# Altium project Coral_Dev_Baseboard.PrjPcb (part 5 of 5)

## Sheet 09_EXP_CN_100PIN.SchDoc
size A2; ApprovedBy: DNP; CheckedBy: DNP; Author: DNP; CompanyName: Google LLC; DrawnBy: DNP; Engineer: Bangfei/Michael/Leo; Organization: Google LLC; Address1: 1600 Amphitheatre Parkway; Address2: Mountain View, CA 94043; Address3: DNP; Address4: DNP; DocumentNumber: DNP; Revision: PVT; SheetNumber: 9; SheetTotal: 11; VersionControl_RevNumber: DNP; IsUserConfigurable: DNP; Time: DNP; ImagePath: DNP; Rule: DNP; ProjectName: Enterprise; Application_BuildNumber: DNP
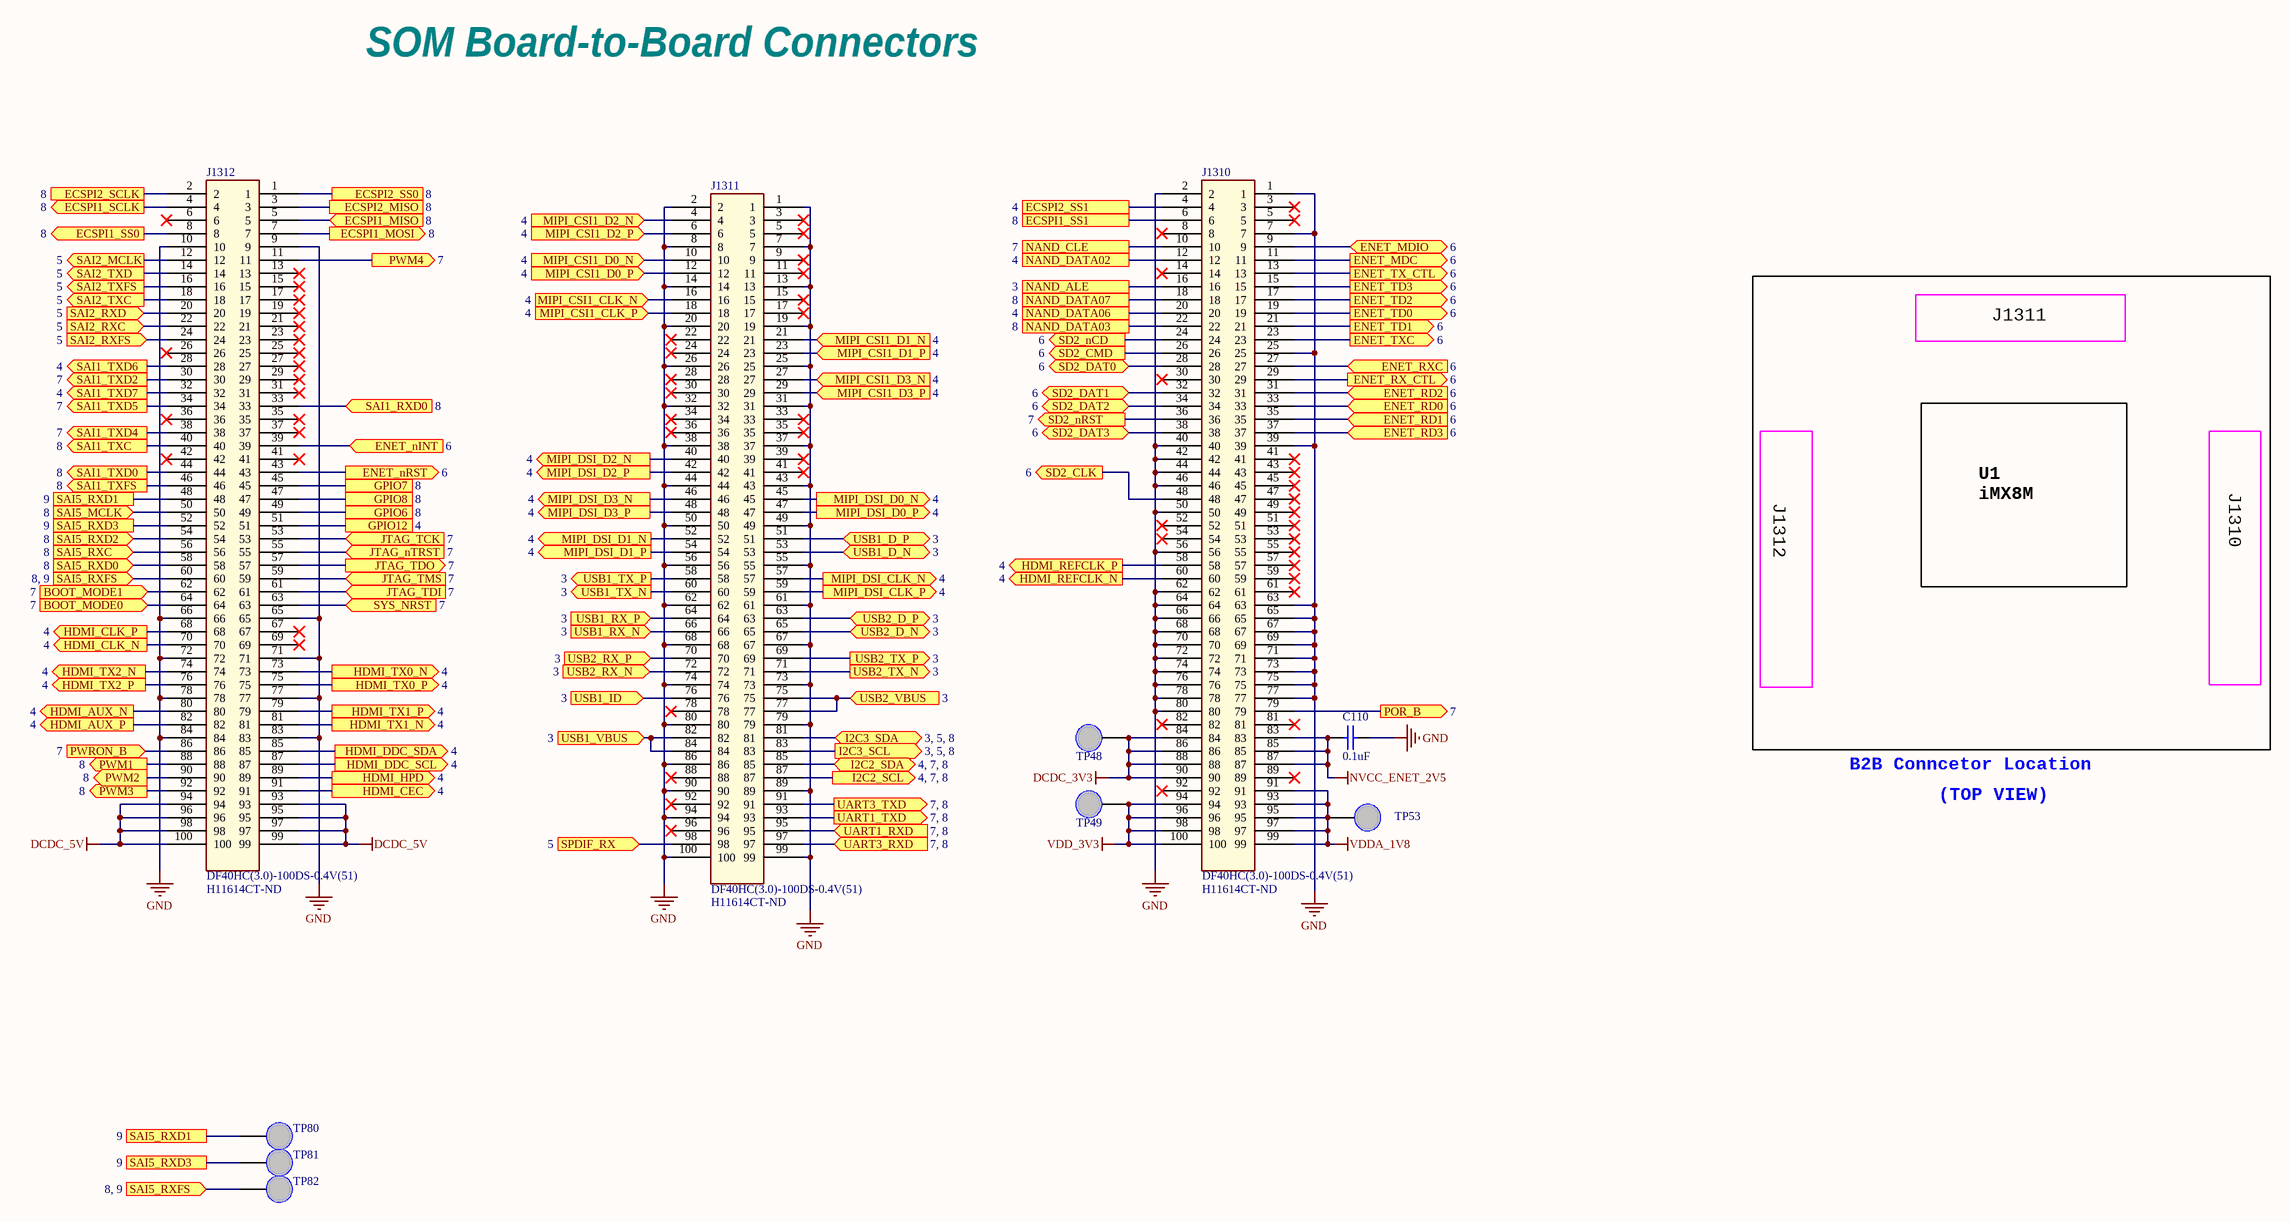
[diagram p13: 09_EXP_CN_100PIN.SchDoc]

### Parts
C110  value 0.1uF  [0201]  (hidden comment: 0.1uF/10V)
J1310  DF40HC(3.0)-100DS-0.4V(51)  Supplier Part Number 1: H11614CT-ND  [DF40HC-3_0-100DS-0_4V-51]
J1311  DF40HC(3.0)-100DS-0.4V(51)  Supplier Part Number 1: H11614CT-ND  [DF40HC-3_0-100DS-0_4V-51]
J1312  DF40HC(3.0)-100DS-0.4V(51)  Supplier Part Number 1: H11614CT-ND  [DF40HC-3_0-100DS-0_4V-51]
TP48  TP NM  [TP_SMD_L]  (value not drawn)  (no BOM)
TP49  TP NM  [TP_SMD_L]  (value not drawn)  (no BOM)
TP53  TP NM  [TP_SMD_L]  (value not drawn)  (no BOM)
TP80  TP NM  [TP_SMD_L]  (value not drawn)  (no BOM)
TP81  TP NM  [TP_SMD_L]  (value not drawn)  (no BOM)
TP82  TP NM  [TP_SMD_L]  (value not drawn)  (no BOM)

### Ports
BOOT_MODE0 (in, see 7), BOOT_MODE1 (in, see 7), ECSPI1_MISO (in, see 8), ECSPI1_MOSI (out, see 8), ECSPI1_SCLK (out, see 8), ECSPI1_SS0 (out, see 8), ECSPI1_SS1 (see 8), ECSPI2_MISO (see 8), ECSPI2_SCLK (see 8), ECSPI2_SS0 (see 8), ECSPI2_SS1 (see 4), ENET_MDC (out, see 6), ENET_MDIO (bidir, see 6), ENET_nINT (in, see 6), ENET_nRST (out, see 6), ENET_RD0 (in, see 6), ENET_RD1 (in, see 6), ENET_RD2 (in, see 6), ENET_RD3 (in, see 6), ENET_RX_CTL (out, see 6), ENET_RXC (in, see 6), ENET_TD0 (out, see 6), ENET_TD1 (out, see 6), ENET_TD2 (out, see 6), ENET_TD3 (out, see 6), ENET_TX_CTL (out, see 6), ENET_TXC (out, see 6), GPIO6 (see 8), GPIO7 (see 8), GPIO8 (see 8), GPIO12 (see 4), HDMI_AUX_N (out, see 4), HDMI_AUX_P (out, see 4), HDMI_CEC (out, see 4), HDMI_CLK_N (out, see 4), HDMI_CLK_P (out, see 4), HDMI_DDC_SCL (out, see 4), HDMI_DDC_SDA (out, see 4), HDMI_HPD (out, see 4), HDMI_REFCLK_N (out, see 4), HDMI_REFCLK_P (out, see 4), HDMI_TX0_N (out, see 4), HDMI_TX0_P (out, see 4), HDMI_TX1_N (out, see 4), HDMI_TX1_P (out, see 4), HDMI_TX2_N (out, see 4), HDMI_TX2_P (out, see 4), I2C2_SCL (out, see 4, 7, 8), I2C2_SDA (bidir, see 4, 7, 8), I2C3_SCL (out, see 3, 5, 8), I2C3_SDA (bidir, see 3, 5, 8), JTAG_nTRST (in, see 7), JTAG_TCK (in, see 7), JTAG_TDI (in, see 7), JTAG_TDO (out, see 7), JTAG_TMS (in, see 7), MIPI_CSI1_CLK_N (in, see 4), MIPI_CSI1_CLK_P (in, see 4), MIPI_CSI1_D0_N (in, see 4), MIPI_CSI1_D0_P (in, see 4), MIPI_CSI1_D1_N (in, see 4), MIPI_CSI1_D1_P (in, see 4), MIPI_CSI1_D2_N (in, see 4), MIPI_CSI1_D2_P (in, see 4), MIPI_CSI1_D3_N (in, see 4), MIPI_CSI1_D3_P (in, see 4), MIPI_DSI_CLK_N (out, see 4), MIPI_DSI_CLK_P (out, see 4), MIPI_DSI_D0_N (out, see 4), MIPI_DSI_D0_P (out, see 4), MIPI_DSI_D1_N (out, see 4), MIPI_DSI_D1_P (out, see 4), MIPI_DSI_D2_N (out, see 4), MIPI_DSI_D2_P (out, see 4), MIPI_DSI_D3_N (out, see 4), MIPI_DSI_D3_P (out, see 4), NAND_ALE (see 3), NAND_CLE (see 7), NAND_DATA02 (see 4), NAND_DATA03 (see 8), NAND_DATA06 (see 4), NAND_DATA07 (see 8), POR_B (out, see 7), PWM1 (out, see 8), PWM2 (out, see 8), PWM3 (out, see 8), PWM4 (out, see 7), PWRON_B (in, see 7), SAI1_RXD0 (in, see 8), SAI1_TXC (out, see 8), SAI1_TXD0 (out, see 8), SAI1_TXD2 (out, see 7), SAI1_TXD4 (out, see 7), SAI1_TXD5 (out, see 7), SAI1_TXD6 (out, see 4), SAI1_TXD7 (out, see 4), SAI1_TXFS (out, see 8), SAI2_MCLK (out, see 5), SAI2_RXC (in, see 5), SAI2_RXD (in, see 5), SAI2_RXFS (in, see 5), SAI2_TXC (out, see 5), SAI2_TXD (out, see 5), SAI2_TXFS (out, see 5), SAI5_MCLK (in, see 8), SAI5_RXC (in, see 8), SAI5_RXD0 (in, see 8), SAI5_RXD1 (see 9), SAI5_RXD2 (in, see 8), SAI5_RXD3 (see 9), SAI5_RXFS (in, see 8, 9), SD2_CLK (out, see 6), SD2_CMD (out, see 6), SD2_DAT0 (bidir, see 6), SD2_DAT1 (bidir, see 6), SD2_DAT2 (bidir, see 6), SD2_DAT3 (bidir, see 6), SD2_nCD (out, see 6), SD2_nRST (out, see 7), SPDIF_RX (in, see 5), SYS_NRST (in, see 7), UART1_RXD (in, see 7, 8), UART1_TXD (out, see 7, 8), UART3_RXD (in, see 7, 8), UART3_TXD (out, see 7, 8), USB1_D_N (bidir, see 3), USB1_D_P (bidir, see 3), USB1_ID (in, see 3), USB1_RX_N (in, see 3), USB1_RX_P (in, see 3), USB1_TX_N (out, see 3), USB1_TX_P (out, see 3), USB1_VBUS (in, see 3), USB2_D_N (bidir, see 3), USB2_D_P (bidir, see 3), USB2_RX_N (in, see 3), USB2_RX_P (in, see 3), USB2_TX_N (out, see 3), USB2_TX_P (out, see 3), USB2_VBUS (in, see 3)

### Nets
DCDC_3V3: J1310.84 J1310.86 J1310.88 J1310.90 TP48.1
DCDC_5V: J1312.93 J1312.94 J1312.95 J1312.96 J1312.97 J1312.98 J1312.99 J1312.100
GND: C110.2 J1310.1 J1310.2 J1310.7 J1310.25 J1310.39 J1310.40 J1310.42 J1310.44 J1310.46 J1310.50 J1310.56 J1310.62 J1310.63 J1310.64 J1310.65 J1310.66 J1310.67 J1310.68 J1310.69 J1310.70 J1310.71 J1310.72 J1310.73 J1310.74 J1310.75 J1310.76 J1310.77 J1310.78 J1310.80 J1311.1 J1311.2 J1311.7 J1311.8 J1311.13 J1311.14 J1311.19 J1311.20 J1311.25 J1311.26 J1311.31 J1311.32 J1311.37 J1311.38 J1311.43 J1311.44 J1311.49 J1311.50 J1311.55 J1311.56 J1311.61 J1311.62 J1311.67 J1311.68 J1311.73 J1311.74 J1311.79 J1311.80 J1311.86 J1311.89 J1311.90 J1311.94 J1311.99 J1311.100 J1312.9 J1312.10 J1312.65 J1312.66 J1312.71 J1312.72 J1312.77 J1312.78 J1312.83 J1312.84
NVCC_ENET_2V5: C110.1 J1310.83 J1310.85 J1310.87
VDD_3V3: J1310.94 J1310.96 J1310.98 J1310.100 TP49.1
VDDA_1V8: J1310.91 J1310.93 J1310.95 J1310.97 J1310.99 TP53.1
BOOT_MODE0: J1312.64 ; port BOOT_MODE0
BOOT_MODE1: J1312.62 ; port BOOT_MODE1
ECSPI1_MISO: J1312.5 ; port ECSPI1_MISO
ECSPI1_MOSI: J1312.7 ; port ECSPI1_MOSI
ECSPI1_SCLK: J1312.4 ; port ECSPI1_SCLK
ECSPI1_SS0: J1312.8 ; port ECSPI1_SS0
ECSPI1_SS1: J1310.6 ; port ECSPI1_SS1
ECSPI2_MISO: J1312.3 ; port ECSPI2_MISO
ECSPI2_SCLK: J1312.2 ; port ECSPI2_SCLK
ECSPI2_SS0: J1312.1 ; port ECSPI2_SS0
ECSPI2_SS1: J1310.4 ; port ECSPI2_SS1
ENET_MDC: J1310.11 ; port ENET_MDC
ENET_MDIO: J1310.9 ; port ENET_MDIO
ENET_nINT: J1312.39 ; port ENET_nINT
ENET_nRST: J1312.43 ; port ENET_nRST
ENET_RD0: J1310.33 ; port ENET_RD0
ENET_RD1: J1310.35 ; port ENET_RD1
ENET_RD2: J1310.31 ; port ENET_RD2
ENET_RD3: J1310.37 ; port ENET_RD3
ENET_RX_CTL: J1310.29 ; port ENET_RX_CTL
ENET_RXC: J1310.27 ; port ENET_RXC
ENET_TD0: J1310.19 ; port ENET_TD0
ENET_TD1: J1310.21 ; port ENET_TD1
ENET_TD2: J1310.17 ; port ENET_TD2
ENET_TD3: J1310.15 ; port ENET_TD3
ENET_TX_CTL: J1310.13 ; port ENET_TX_CTL
ENET_TXC: J1310.23 ; port ENET_TXC
GPIO6: J1312.49 ; port GPIO6
GPIO7: J1312.45 ; port GPIO7
GPIO8: J1312.47 ; port GPIO8
GPIO12: J1312.51 ; port GPIO12
HDMI_AUX_N: J1312.80 ; port HDMI_AUX_N
HDMI_AUX_P: J1312.82 ; port HDMI_AUX_P
HDMI_CEC: J1312.91 ; port HDMI_CEC
HDMI_CLK_N: J1312.70 ; port HDMI_CLK_N
HDMI_CLK_P: J1312.68 ; port HDMI_CLK_P
HDMI_DDC_SCL: J1312.87 ; port HDMI_DDC_SCL
HDMI_DDC_SDA: J1312.85 ; port HDMI_DDC_SDA
HDMI_HPD: J1312.89 ; port HDMI_HPD
HDMI_REFCLK_N: J1310.60 ; port HDMI_REFCLK_N
HDMI_REFCLK_P: J1310.58 ; port HDMI_REFCLK_P
HDMI_TX0_N: J1312.73 ; port HDMI_TX0_N
HDMI_TX0_P: J1312.75 ; port HDMI_TX0_P
HDMI_TX1_N: J1312.81 ; port HDMI_TX1_N
HDMI_TX1_P: J1312.79 ; port HDMI_TX1_P
HDMI_TX2_N: J1312.74 ; port HDMI_TX2_N
HDMI_TX2_P: J1312.76 ; port HDMI_TX2_P
I2C2_SCL: J1311.87 ; port I2C2_SCL
I2C2_SDA: J1311.85 ; port I2C2_SDA
I2C3_SCL: J1311.83 ; port I2C3_SCL
I2C3_SDA: J1311.81 ; port I2C3_SDA
JTAG_nTRST: J1312.55 ; port JTAG_nTRST
JTAG_TCK: J1312.53 ; port JTAG_TCK
JTAG_TDI: J1312.61 ; port JTAG_TDI
JTAG_TDO: J1312.57 ; port JTAG_TDO
JTAG_TMS: J1312.59 ; port JTAG_TMS
MIPI_CSI1_CLK_N: J1311.16 ; port MIPI_CSI1_CLK_N
MIPI_CSI1_CLK_P: J1311.18 ; port MIPI_CSI1_CLK_P
MIPI_CSI1_D0_N: J1311.10 ; port MIPI_CSI1_D0_N
MIPI_CSI1_D0_P: J1311.12 ; port MIPI_CSI1_D0_P
MIPI_CSI1_D1_N: J1311.21 ; port MIPI_CSI1_D1_N
MIPI_CSI1_D1_P: J1311.23 ; port MIPI_CSI1_D1_P
MIPI_CSI1_D2_N: J1311.4 ; port MIPI_CSI1_D2_N
MIPI_CSI1_D2_P: J1311.6 ; port MIPI_CSI1_D2_P
MIPI_CSI1_D3_N: J1311.27 ; port MIPI_CSI1_D3_N
MIPI_CSI1_D3_P: J1311.29 ; port MIPI_CSI1_D3_P
MIPI_DSI_CLK_N: J1311.57 ; port MIPI_DSI_CLK_N
MIPI_DSI_CLK_P: J1311.59 ; port MIPI_DSI_CLK_P
MIPI_DSI_D0_N: J1311.45 ; port MIPI_DSI_D0_N
MIPI_DSI_D0_P: J1311.47 ; port MIPI_DSI_D0_P
MIPI_DSI_D1_N: J1311.52 ; port MIPI_DSI_D1_N
MIPI_DSI_D1_P: J1311.54 ; port MIPI_DSI_D1_P
MIPI_DSI_D2_N: J1311.40 ; port MIPI_DSI_D2_N
MIPI_DSI_D2_P: J1311.42 ; port MIPI_DSI_D2_P
MIPI_DSI_D3_N: J1311.46 ; port MIPI_DSI_D3_N
MIPI_DSI_D3_P: J1311.48 ; port MIPI_DSI_D3_P
NAND_ALE: J1310.16 ; port NAND_ALE
NAND_DATA02: J1310.12 ; port NAND_DATA02
NAND_DATA03: J1310.22 ; port NAND_DATA03
NAND_DATA06: J1310.20 ; port NAND_DATA06
NAND_DATA07: J1310.18 ; port NAND_DATA07
POR_B: J1310.79 ; port POR_B
PWM1: J1312.88 ; port PWM1
PWM2: J1312.90 ; port PWM2
PWM3: J1312.92 ; port PWM3
PWM4: J1312.11 ; port PWM4
SAI1_RXD0: J1312.33 ; port SAI1_RXD0
SAI1_TXC: J1312.40 ; port SAI1_TXC
SAI1_TXD0: J1312.44 ; port SAI1_TXD0
SAI1_TXD4: J1312.38 ; port SAI1_TXD4
SAI1_TXD5: J1312.34 ; port SAI1_TXD5
SAI1_TXD6: J1312.28 ; port SAI1_TXD6
SAI1_TXD7: J1312.32 ; port SAI1_TXD7
SAI1_TXFS: J1312.46 ; port SAI1_TXFS
SAI2_MCLK: J1312.12 ; port SAI2_MCLK
SAI2_RXD: J1312.20 ; port SAI2_RXD
SAI2_TXC: J1312.18 ; port SAI2_TXC
SAI2_TXD: J1312.14 ; port SAI2_TXD
SAI2_TXFS: J1312.16 ; port SAI2_TXFS
SAI5_MCLK: J1312.50 ; port SAI5_MCLK
SAI5_RXC: J1312.56 ; port SAI5_RXC
SAI5_RXD0: J1312.58 ; port SAI5_RXD0
SAI5_RXD2: J1312.54 ; port SAI5_RXD2
SAI5_RXFS: J1312.60 TP82.1 ; port SAI5_RXFS
SD2_nCD: J1310.24 ; port SD2_nCD
SD2_nRST: J1310.36 ; port SD2_nRST
SD_CD_DAT3: J1310.38 ; port SD2_DAT3
SD_CLK: J1310.48 ; port SD2_CLK
SD_CMD: J1310.26 ; port SD2_CMD
SD_DAT0: J1310.28 ; port SD2_DAT0
SD_DAT1: J1310.32 ; port SD2_DAT1
SD_DAT2: J1310.34 ; port SD2_DAT2
SPDIF_RX: J1311.98 ; port SPDIF_RX
SYS_NRST: J1312.63 ; port SYS_NRST
UART1_RXD: J1311.95 ; port UART1_RXD
UART1_TXD: J1311.93 ; port UART1_TXD
UART3_RXD: J1311.97 ; port UART3_RXD
UART3_TXD: J1311.91 ; port UART3_TXD
USB1_D_N: J1311.53 ; port USB1_D_N
USB1_D_P: J1311.51 ; port USB1_D_P
USB1_ID: J1311.76 ; port USB1_ID
USB1_RX_N: J1311.66 ; port USB1_RX_N
USB1_RX_P: J1311.64 ; port USB1_RX_P
USB1_TX_N: J1311.60 ; port USB1_TX_N
USB1_TX_P: J1311.58 ; port USB1_TX_P
USB1_VBUS: J1311.82 J1311.84 ; port USB1_VBUS
USB2_D_N: J1311.65 ; port USB2_D_N
USB2_D_P: J1311.63 ; port USB2_D_P
USB2_RX_N: J1311.72 ; port USB2_RX_N
USB2_RX_P: J1311.70 ; port USB2_RX_P
USB2_TX_N: J1311.71 ; port USB2_TX_N
USB2_TX_P: J1311.69 ; port USB2_TX_P
USB2_VBUS: J1311.75 J1311.77 ; port USB2_VBUS
NetJ1310_10: J1310.10 ; port NAND_CLE
NetJ1312_22: J1312.22 ; port SAI2_RXC
NetJ1312_24: J1312.24 ; port SAI2_RXFS
NetJ1312_30: J1312.30 ; port SAI1_TXD2
NetJ1312_48: J1312.48 TP80.1 ; port SAI5_RXD1
NetJ1312_52: J1312.52 TP81.1 ; port SAI5_RXD3
NetJ1312_86: J1312.86 ; port PWRON_B

Not connected (* = marked no-connect by the designer): J1310 3* 5* 8* 14* 30* 41* 43* 45* 47* 49* 51* 52* 53* 54* 55* 57* 59* 61* 81* 82* 89* 92*; J1311 3* 5* 9* 11* 15* 17* 22* 24* 28* 30* 33* 34* 35* 36* 39* 41* 78* 88* 92* 96*; J1312 6* 13* 15* 17* 19* 21* 23* 25* 26* 27* 29* 31* 35* 36* 37* 41* 42* 67* 69*

### Notes on the sheet
- SOM Board-to-Board Connectors
- J1311
- J1312
- U1
  iMX8M
- J1310
- B2B Conncetor Location
- (TOP VIEW)
- Project:
- Engineer:
- Date:
- File:
- Revision:
- Sheet
- of

### Library data of the parts
C110 = CAP_0201_0.1uF: CAP CER 0.1UF 10V 10% X5R 0201; MPN: C0603X5R1A104K030BC; QCI MPN: GRM033R61A104K; QPN: CH4102K9E00; QPN Description: CAP CHIP 0.1U 10V(+-10%,X5R,0201); Function Code: DOK; Supplier 1: Digi-Key; Supplier Part Number 1: 445-7318-1-ND; QCI Supplier: MUR
J1310-J1312 = CONN_HIROSE-DF40C-100DP-0.4V(51): CONN HDR 100POS 0.4MM SMD GOLD; Function Code: DOK; QPN: DFHSA0FR017; QPN Description: CONN HOUSING 100P 2R FR(P0.4,H2.9); QCI Supplier: HRS; Supplier 1: Digi-Key; MPN: DF40HC(3.0)-100DS-0.4V(51); QCI MPN: DF40HC(3.0)-100DS-0.4V(51)
TP48 TP49 TP53 TP80-TP82 = TP_L: TEST POINT (Large)

## Sheet 10_MISC.SchDoc
size A2; ApprovedBy: DNP; CheckedBy: DNP; Author: DNP; CompanyName: Google LLC; DrawnBy: DNP; Engineer: Bangfei/Michael/Leo; Organization: Google LLC; Address1: 1600 Amphitheatre Parkway; Address2: Mountain View, CA 94043; Address3: DNP; Address4: DNP; DocumentNumber: DNP; Revision: PVT; SheetNumber: 10; SheetTotal: 11; VersionControl_RevNumber: DNP; IsUserConfigurable: DNP; Time: DNP; ImagePath: DNP; Rule: DNP; ProjectName: Enterprise; Application_BuildNumber: DNP
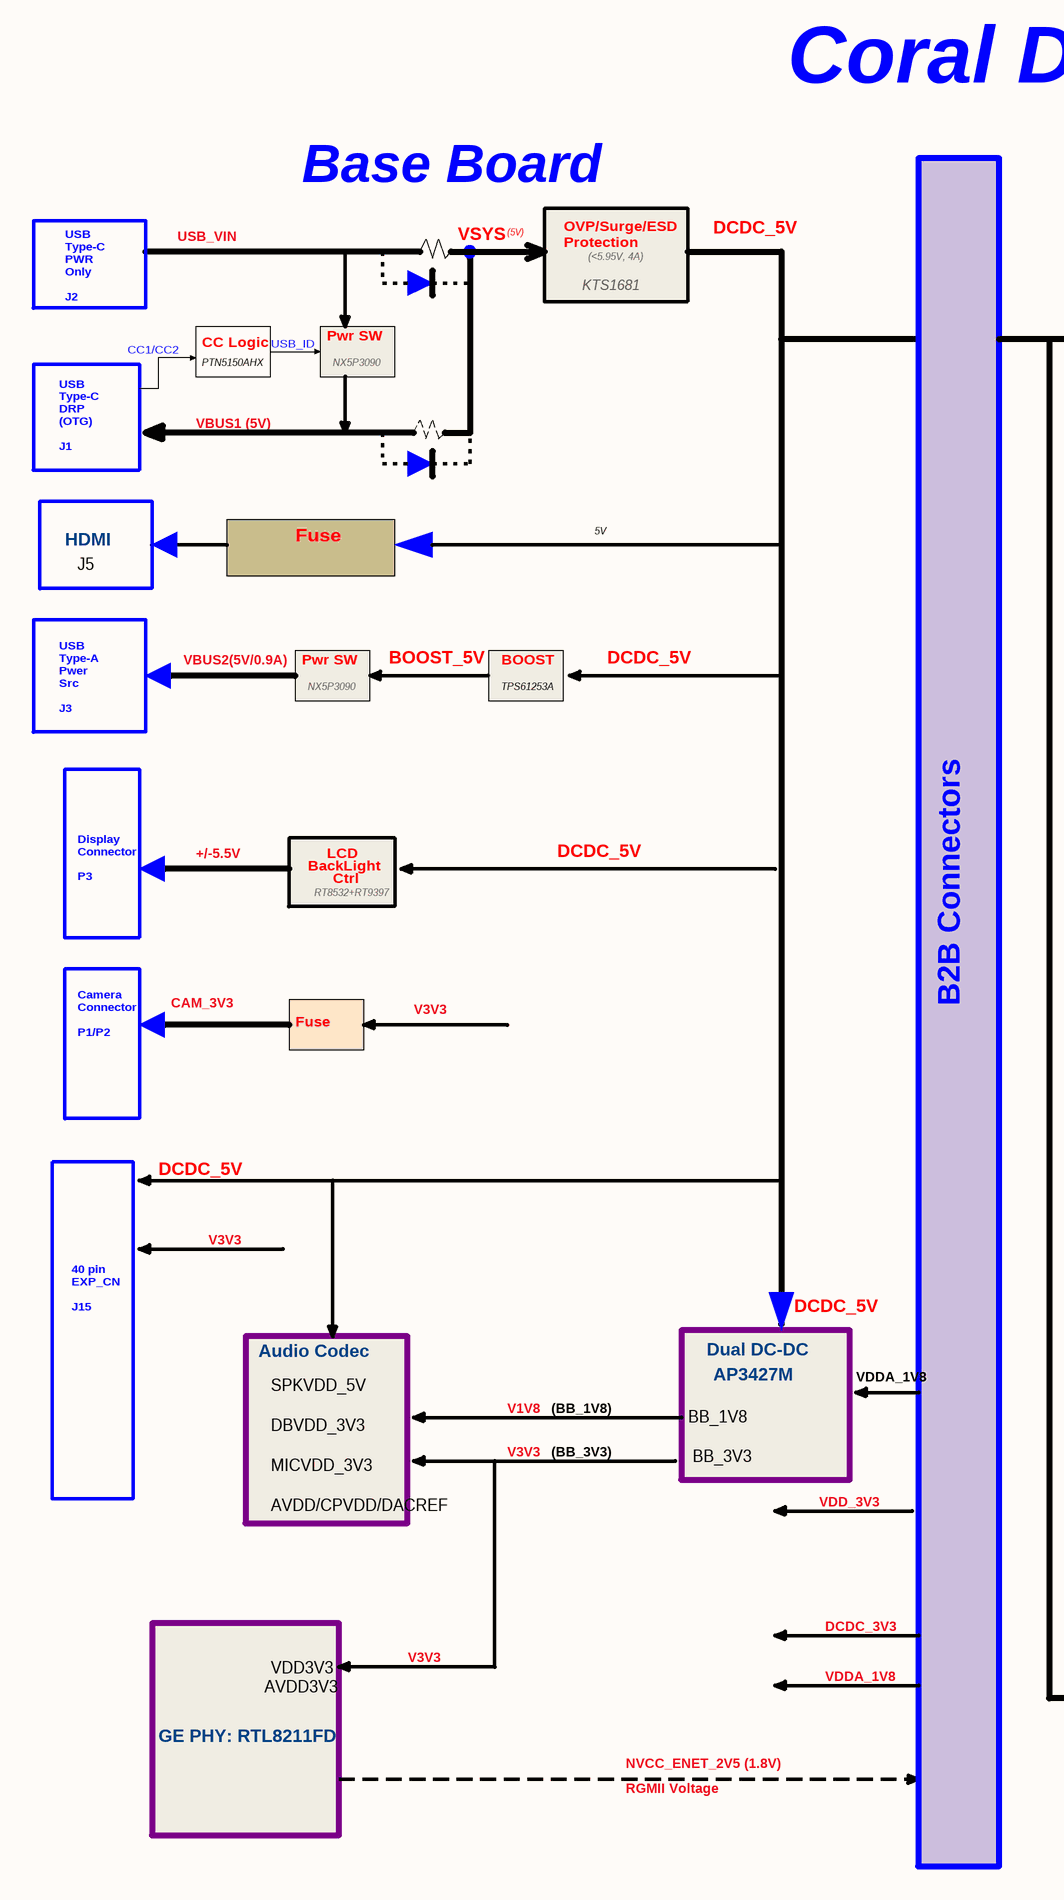
[diagram p14: 10_MISC.SchDoc, left]
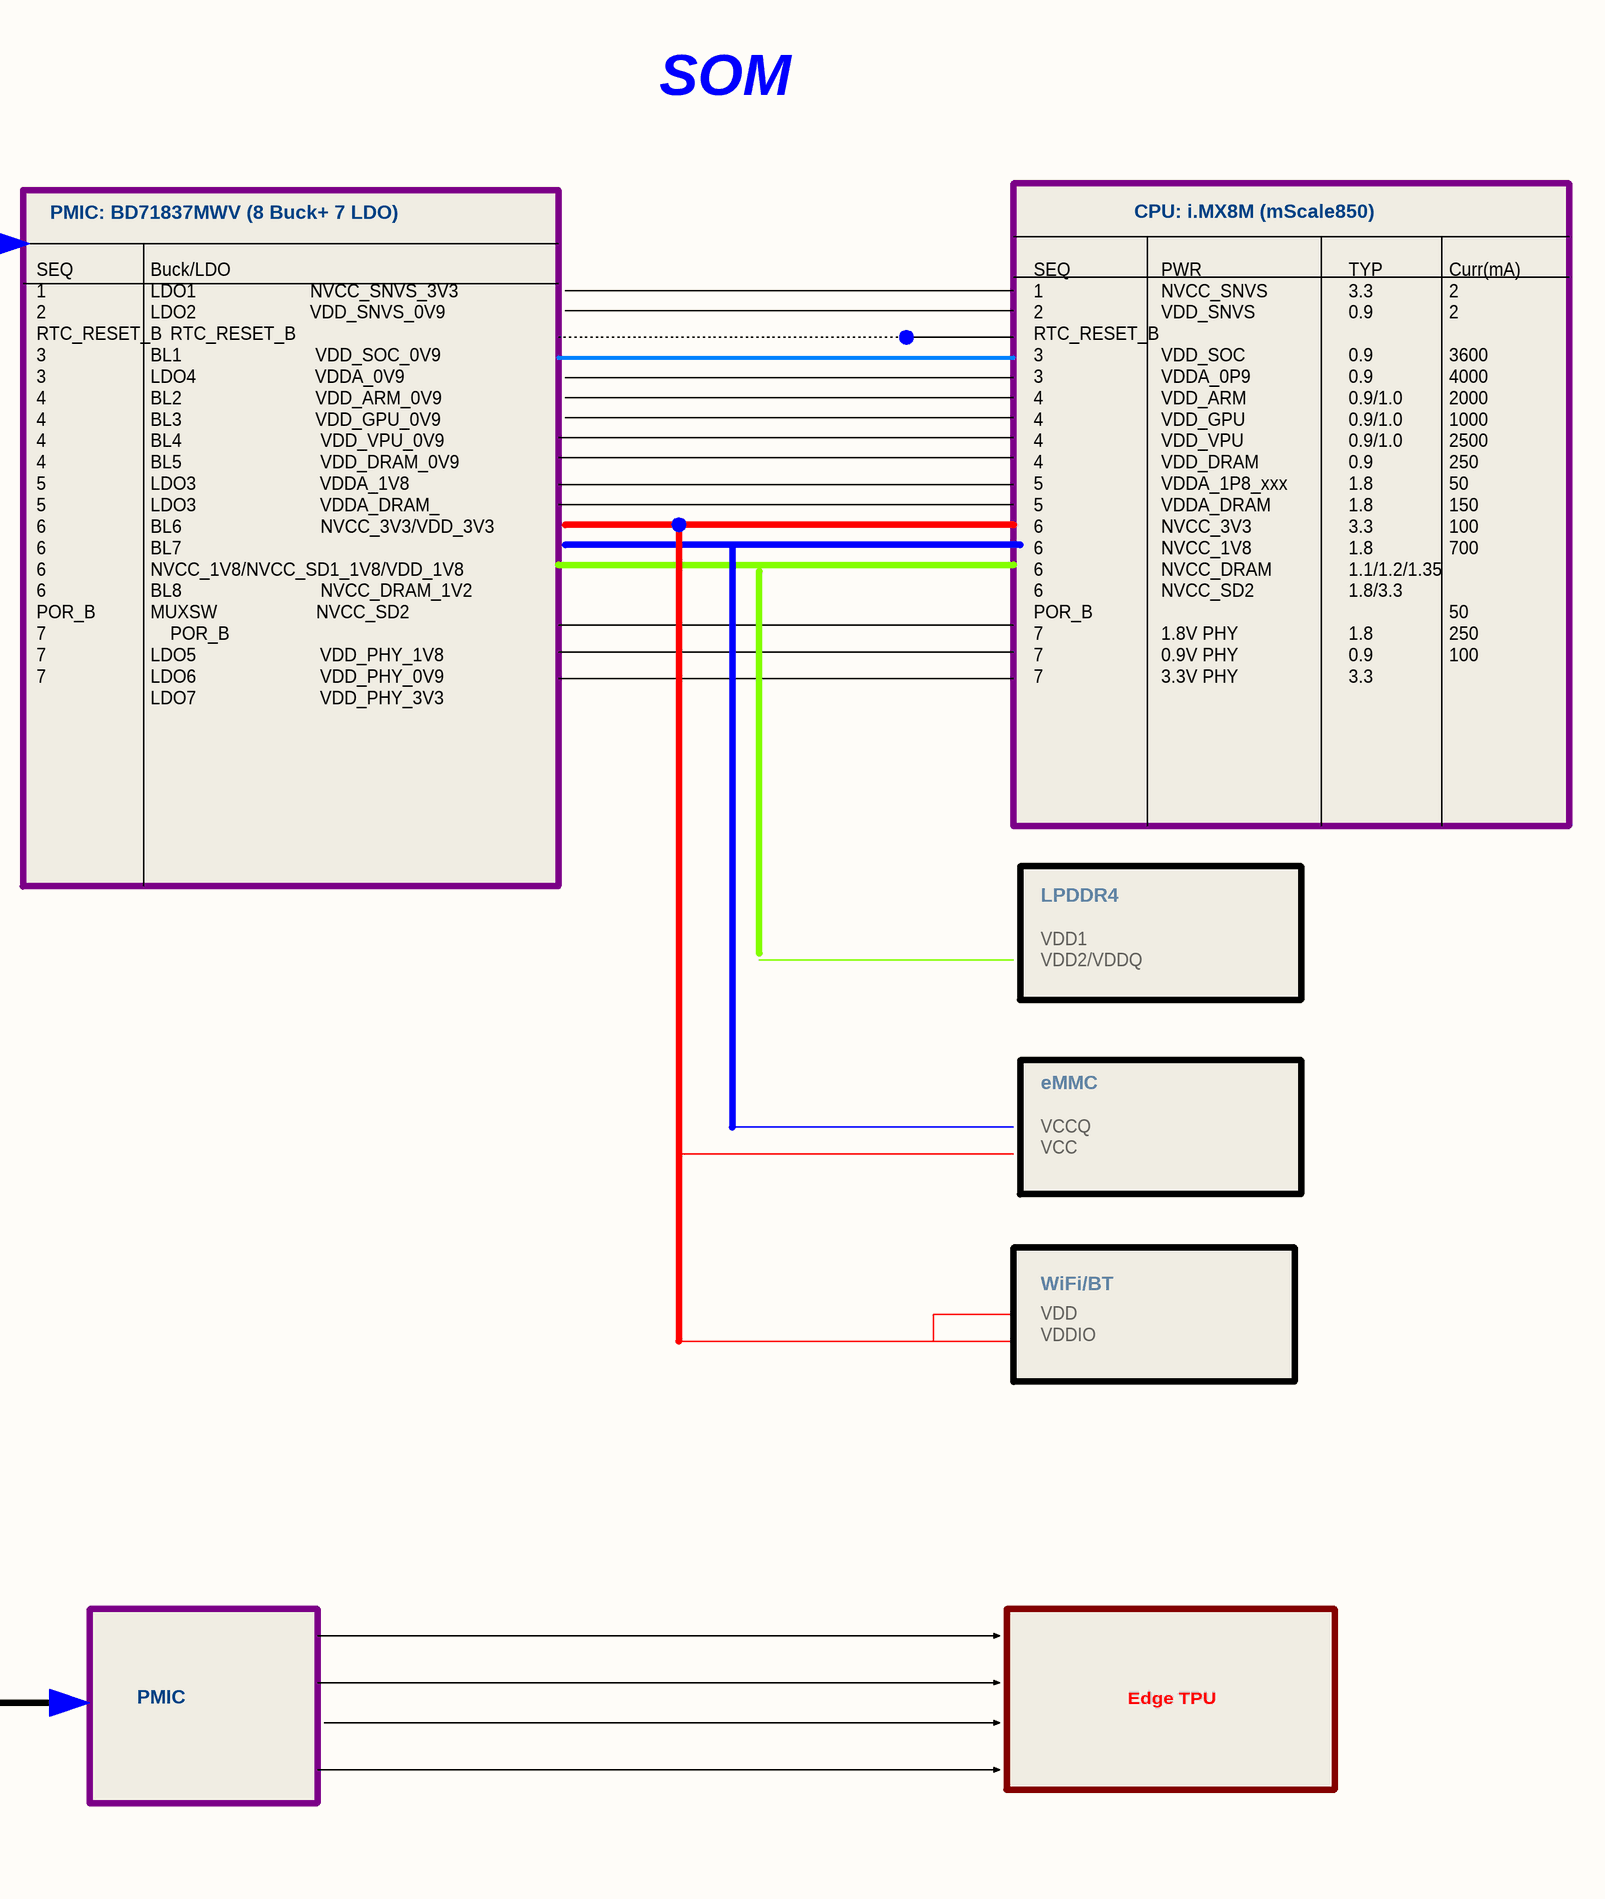
[diagram p15: 10_MISC.SchDoc, right]

### Notes on the sheet
- Coral Dev Board  Power Diagram
- Base Board
- SOM
- USB_VIN
- VSYS
- (5V)
- OVP/Surge/ESD
- Protection
- (<5.95V, 4A)
- DCDC_5V
- USB Type-C
  PWR Only
  J2
- CC1/CC2
- CC Logic
- USB_ID
- Pwr SW
- KTS1681
- PMIC: BD71837MWV (8 Buck+ 7 LDO)
- CPU: i.MX8M (mScale850)
- PTN5150AHX
- NX5P3090
- USB Type-C
  DRP (OTG)
  J1
- VBUS1 (5V)
- 5V
- HDMI
- J5
- Fuse
- USB Type-A
  Pwer Src
  J3
- VBUS2(5V/0.9A)
- BOOST_5V
- BOOST
- TPS61253A
- Display
  Connector
  P3
- +/-5.5V
- BackLight
- RT8532+RT9397
- LCD
- Ctrl
- SEQ
  1
  2
  RTC_RESET_B
  3
  3
  4
  4
  4
  4
  5
  5
  6
  6
  6
  6
  POR_B
  7
  7
  7
- Buck/LDO
  LDO1                       NVCC_SNVS_3V3
  LDO2                       VDD_SNVS_0V9
  RTC_RESET_B
  BL1                           VDD_SOC_0V9
  LDO4                        VDDA_0V9
  BL2                           VDD_ARM_0V9
  BL3                           VDD_GPU_0V9
  BL4                            VDD_VPU_0V9
  BL5                            VDD_DRAM_0V9
  LDO3                         VDDA_1V8
  LDO3                         VDDA_DRAM_
  BL6                            NVCC_3V3/VDD_3V3
  BL7                            NVCC_1V8/NVCC_SD1_1V8/VDD_1V8
  BL8                            NVCC_DRAM_1V2
  MUXSW                    NVCC_SD2
  POR_B
  LDO5                         VDD_PHY_1V8
  LDO6                         VDD_PHY_0V9
  LDO7                         VDD_PHY_3V3
- PWR
  NVCC_SNVS
  VDD_SNVS
  VDD_SOC
  VDDA_0P9
  VDD_ARM
  VDD_GPU
  VDD_VPU
  VDD_DRAM
  VDDA_1P8_xxx
  VDDA_DRAM
  NVCC_3V3
  NVCC_1V8
  NVCC_DRAM
  NVCC_SD2
  1.8V PHY
  0.9V PHY
  3.3V PHY
- TYP
  3.3
  0.9
  0.9
  0.9
  0.9/1.0
  0.9/1.0
  0.9/1.0
  0.9
  1.8
  1.8
  3.3
  1.8
  1.1/1.2/1.35
  1.8/3.3
  1.8
  0.9
  3.3
- Curr(mA)
  2
  2
  3600
  4000
  2000
  1000
  2500
  250
  50
  150
  100
  700
  50
  250
  100
- LPDDR4
- CAM_3V3
- V3V3
- B2B Connectors
- VDD1
  VDD2/VDDQ
- Camera
  Connector
  P1/P2
- eMMC
- VCCQ
  VCC
- 40 pin
  EXP_CN
  J15
- WiFi/BT
- Audio Codec
- Dual DC-DC
- AP3427M
- VDDA_1V8
- VDD
  VDDIO
- V1V8
- (BB_3V3)
- (BB_1V8)
- BB_1V8
  BB_3V3
- SPKVDD_5V
  DBVDD_3V3
  MICVDD_3V3
  AVDD/CPVDD/DACREF
- VDD_3V3
- DCDC_3V3
- AVDD3V3
- VDD3V3
- PMIC
- Edge TPU
- GE PHY: RTL8211FD
- NVCC_ENET_2V5 (1.8V)
- RGMII Voltage
- Project:
- Engineer:
- Date:
- File:
- Revision:
- Sheet
- of

## Sheet 11_CHANGE_LOG.SchDoc
size A2; ApprovedBy: DNP; CheckedBy: DNP; Author: DNP; CompanyName: Google LLC; DrawnBy: DNP; Engineer: Bangfei/Michael/Leo; Organization: Google LLC; Address1: 1600 Amphitheatre Parkway; Address2: Mountain View, CA 94043; Address3: DNP; Address4: DNP; DocumentNumber: DNP; Revision: PVT; SheetNumber: 11; SheetTotal: 11; VersionControl_RevNumber: DNP; IsUserConfigurable: DNP; Time: DNP; ImagePath: DNP; Rule: DNP; ProjectName: Enterprise; Application_BuildNumber: DNP
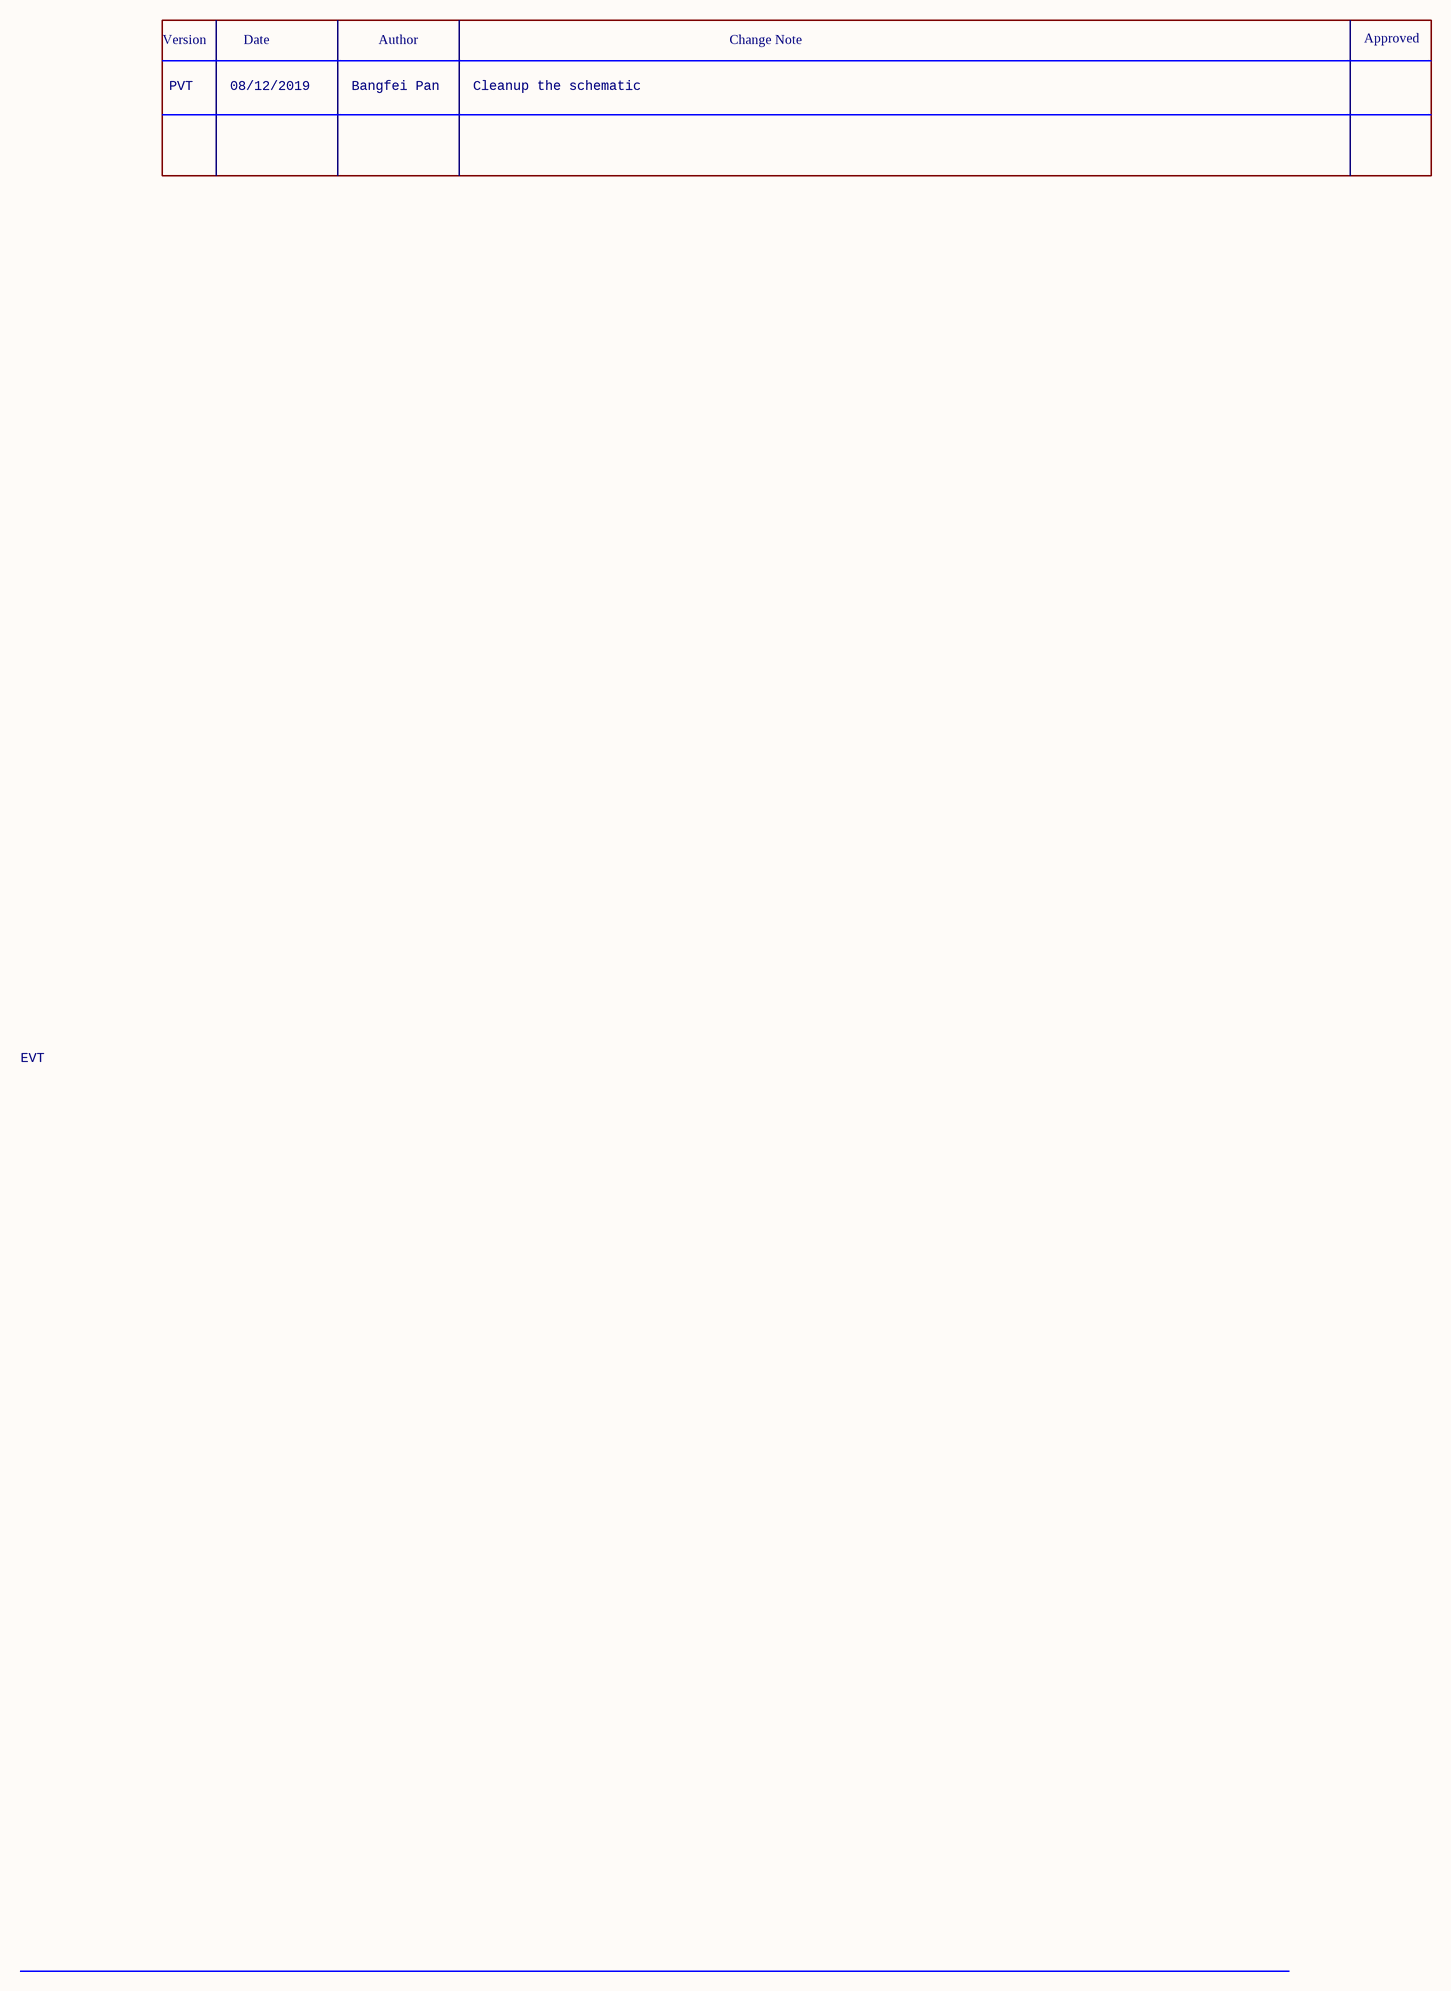
[diagram p16: 11_CHANGE_LOG.SchDoc]

### Notes on the sheet
- Version
- Date
- Author
- Change Note
- Approved
- PVT
- 08/12/2019
- Bangfei Pan
- Cleanup the schematic
- EVT
- Project:
- Engineer:
- Date:
- File:
- Revision:
- Sheet
- of

## Nets that join several sheets
BB_1V8: 03_USB (9 pins), 04_HDMI_MIPI (8 pins), 05_AUDIO (C34.1 FB3.1), 06_GBE_SDCARD (R60.2), 08_EXP_CN (C100.1 L3.2 R128.1 TP35.1)
BB_3V3: 03_USB (10 pins), 04_HDMI_MIPI (10 pins), 05_AUDIO (12 pins), 06_GBE_SDCARD (R61.2 R62.2 R173.2), 07_DEBUG (16 pins), 08_EXP_CN (12 pins)
DCDC_5V: 03_USB (11 pins), 04_HDMI_MIPI (8 pins), 05_AUDIO (C25.1 C26.1 U2.43 U2.47), 07_DEBUG (R198.2 R199.2), 08_EXP_CN (8 pins), 09_EXP_CN_100PIN (8 pins)
GND: 03_USB (85 pins), 04_HDMI_MIPI (76 pins), 05_AUDIO (48 pins), 06_GBE_SDCARD (51 pins), 07_DEBUG (34 pins), 08_EXP_CN (30 pins), 09_EXP_CN_100PIN (74 pins)
NVCC_ENET_2V5: 06_GBE_SDCARD (R52.1), 09_EXP_CN_100PIN (C110.1 J1310.83 J1310.85 J1310.87)
VDD_3V3: 06_GBE_SDCARD (R74.1 R78.1 R141.2), 09_EXP_CN_100PIN (5 pins)
VDDA_1V8: 08_EXP_CN (R13.2 R17.2), 09_EXP_CN_100PIN (6 pins)
VSD_3V3: 06_GBE_SDCARD (6 pins), 07_DEBUG (C93.1 Q21.3 R116.2 R145.2)
BOOT_MODE0: 07_DEBUG (R99.2 SW1.2), 09_EXP_CN_100PIN (J1312.64)
BOOT_MODE1: 07_DEBUG (R89.2 SW1.1), 09_EXP_CN_100PIN (J1312.62)
ECSPI1_MISO: 08_EXP_CN (J15.21), 09_EXP_CN_100PIN (J1312.5)
ECSPI1_MOSI: 08_EXP_CN (J15.19), 09_EXP_CN_100PIN (J1312.7)
ECSPI1_SCLK: 08_EXP_CN (J15.23), 09_EXP_CN_100PIN (J1312.4)
ECSPI1_SS0: 08_EXP_CN (J15.24), 09_EXP_CN_100PIN (J1312.8)
ECSPI1_SS1: 08_EXP_CN (J15.26), 09_EXP_CN_100PIN (J1310.6)
ECSPI2_MISO: 08_EXP_CN (J15.22), 09_EXP_CN_100PIN (J1312.3)
ECSPI2_SCLK: 08_EXP_CN (J15.18), 09_EXP_CN_100PIN (J1312.2)
ECSPI2_SS0: 08_EXP_CN (J15.36), 09_EXP_CN_100PIN (J1312.1)
ECSPI2_SS1: 04_HDMI_MIPI (R171.2), 09_EXP_CN_100PIN (J1310.4)
ENET_MDC: 06_GBE_SDCARD (R63.1 R66.1), 09_EXP_CN_100PIN (J1310.11)
ENET_MDIO: 06_GBE_SDCARD (R64.1 R67.1), 09_EXP_CN_100PIN (J1310.9)
ENET_nINT: 06_GBE_SDCARD (R61.1 U18.31), 09_EXP_CN_100PIN (J1312.39)
ENET_nRST: 06_GBE_SDCARD (R62.1 U18.12), 09_EXP_CN_100PIN (J1312.43)
ENET_RD0: 06_GBE_SDCARD (R85.2 R140.2 U18.25), 09_EXP_CN_100PIN (J1310.33)
ENET_RD1: 06_GBE_SDCARD (R86.2 R177.2 U18.24), 09_EXP_CN_100PIN (J1310.35)
ENET_RD2: 06_GBE_SDCARD (R178.2 U18.23), 09_EXP_CN_100PIN (J1310.31)
ENET_RD3: 06_GBE_SDCARD (R83.2 U18.22), 09_EXP_CN_100PIN (J1310.37)
ENET_RX_CTL: 06_GBE_SDCARD (R81.2 U18.26), 09_EXP_CN_100PIN (J1310.29)
ENET_RXC: 06_GBE_SDCARD (R82.2 U18.27), 09_EXP_CN_100PIN (J1310.27)
ENET_TD0: 06_GBE_SDCARD (U18.18), 09_EXP_CN_100PIN (J1310.19)
ENET_TD1: 06_GBE_SDCARD (U18.17), 09_EXP_CN_100PIN (J1310.21)
ENET_TD2: 06_GBE_SDCARD (U18.16), 09_EXP_CN_100PIN (J1310.17)
ENET_TD3: 06_GBE_SDCARD (U18.15), 09_EXP_CN_100PIN (J1310.15)
ENET_TX_CTL: 06_GBE_SDCARD (U18.19), 09_EXP_CN_100PIN (J1310.13)
ENET_TXC: 06_GBE_SDCARD (U18.20), 09_EXP_CN_100PIN (J1310.23)
GPIO6: 08_EXP_CN (J15.13), 09_EXP_CN_100PIN (J1312.49)
GPIO7: 08_EXP_CN (J15.29), 09_EXP_CN_100PIN (J1312.45)
GPIO8: 08_EXP_CN (J15.31), 09_EXP_CN_100PIN (J1312.47)
GPIO12: 04_HDMI_MIPI (R137.1), 09_EXP_CN_100PIN (J1312.51)
HDMI_AUX_N: 04_HDMI_MIPI (C54.1), 09_EXP_CN_100PIN (J1312.80)
HDMI_AUX_P: 04_HDMI_MIPI (C51.1), 09_EXP_CN_100PIN (J1312.82)
HDMI_CEC: 04_HDMI_MIPI (ESD13.2 J5.13 R40.1), 09_EXP_CN_100PIN (J1312.91)
HDMI_CLK_N: 04_HDMI_MIPI (C58.1), 09_EXP_CN_100PIN (J1312.70)
HDMI_CLK_P: 04_HDMI_MIPI (C57.1), 09_EXP_CN_100PIN (J1312.68)
HDMI_DDC_SCL: 04_HDMI_MIPI (ESD12.2 J5.15 R39.1), 09_EXP_CN_100PIN (J1312.87)
HDMI_DDC_SDA: 04_HDMI_MIPI (ESD8.2 J5.16 R38.1), 09_EXP_CN_100PIN (J1312.85)
HDMI_HPD: 04_HDMI_MIPI (J5.19 R47.2 U10.A2), 09_EXP_CN_100PIN (J1312.89)
HDMI_REFCLK_N: 04_HDMI_MIPI (Y1.5), 09_EXP_CN_100PIN (J1310.60)
HDMI_REFCLK_P: 04_HDMI_MIPI (Y1.4), 09_EXP_CN_100PIN (J1310.58)
HDMI_TX0_N: 04_HDMI_MIPI (C56.1), 09_EXP_CN_100PIN (J1312.73)
HDMI_TX0_P: 04_HDMI_MIPI (C55.1), 09_EXP_CN_100PIN (J1312.75)
HDMI_TX1_N: 04_HDMI_MIPI (C63.1), 09_EXP_CN_100PIN (J1312.81)
HDMI_TX1_P: 04_HDMI_MIPI (C62.1), 09_EXP_CN_100PIN (J1312.79)
HDMI_TX2_N: 04_HDMI_MIPI (C61.1), 09_EXP_CN_100PIN (J1312.74)
HDMI_TX2_P: 04_HDMI_MIPI (C60.1), 09_EXP_CN_100PIN (J1312.76)
I2C2_SCL: 04_HDMI_MIPI (R129.1 R130.1), 07_DEBUG (R202.1), 08_EXP_CN (J15.5), 09_EXP_CN_100PIN (J1311.87)
I2C2_SDA: 04_HDMI_MIPI (R132.1 R133.1), 07_DEBUG (R203.1), 08_EXP_CN (J15.3), 09_EXP_CN_100PIN (J1311.85)
I2C3_SCL: 03_USB (U9.8), 05_AUDIO (U2.39), 08_EXP_CN (J15.28), 09_EXP_CN_100PIN (J1311.83)
I2C3_SDA: 03_USB (U9.7), 05_AUDIO (U2.40), 08_EXP_CN (J15.27), 09_EXP_CN_100PIN (J1311.81)
JTAG_nTRST: 07_DEBUG (R111.2), 09_EXP_CN_100PIN (J1312.55)
JTAG_TCK: 07_DEBUG (J12.4), 09_EXP_CN_100PIN (J1312.53)
JTAG_TDI: 07_DEBUG (J12.8 R106.1), 09_EXP_CN_100PIN (J1312.61)
JTAG_TDO: 07_DEBUG (J12.6), 09_EXP_CN_100PIN (J1312.57)
JTAG_TMS: 07_DEBUG (J12.2 R105.1), 09_EXP_CN_100PIN (J1312.59)
MIPI_CSI1_CLK_N: 04_HDMI_MIPI (P1.5 TP63.1), 09_EXP_CN_100PIN (J1311.16)
MIPI_CSI1_CLK_P: 04_HDMI_MIPI (P1.6 TP64.1), 09_EXP_CN_100PIN (J1311.18)
MIPI_CSI1_D0_N: 04_HDMI_MIPI (P1.2 TP61.1), 09_EXP_CN_100PIN (J1311.10)
MIPI_CSI1_D0_P: 04_HDMI_MIPI (P1.3 TP62.1), 09_EXP_CN_100PIN (J1311.12)
MIPI_CSI1_D1_N: 04_HDMI_MIPI (P1.8 TP65.1), 09_EXP_CN_100PIN (J1311.21)
MIPI_CSI1_D1_P: 04_HDMI_MIPI (P1.9 TP66.1), 09_EXP_CN_100PIN (J1311.23)
MIPI_CSI1_D2_N: 04_HDMI_MIPI (P1.11), 09_EXP_CN_100PIN (J1311.4)
MIPI_CSI1_D2_P: 04_HDMI_MIPI (P1.12), 09_EXP_CN_100PIN (J1311.6)
MIPI_CSI1_D3_N: 04_HDMI_MIPI (P1.14 TP69.1), 09_EXP_CN_100PIN (J1311.27)
MIPI_CSI1_D3_P: 04_HDMI_MIPI (P1.15 TP70.1), 09_EXP_CN_100PIN (J1311.29)
MIPI_DSI_CLK_N: 04_HDMI_MIPI (P3.13 TP56.1), 09_EXP_CN_100PIN (J1311.57)
MIPI_DSI_CLK_P: 04_HDMI_MIPI (P3.12 TP55.1), 09_EXP_CN_100PIN (J1311.59)
MIPI_DSI_D0_N: 04_HDMI_MIPI (P3.16), 09_EXP_CN_100PIN (J1311.45)
MIPI_DSI_D0_P: 04_HDMI_MIPI (P3.15), 09_EXP_CN_100PIN (J1311.47)
MIPI_DSI_D1_N: 04_HDMI_MIPI (P3.10), 09_EXP_CN_100PIN (J1311.52)
MIPI_DSI_D1_P: 04_HDMI_MIPI (P3.9), 09_EXP_CN_100PIN (J1311.54)
MIPI_DSI_D2_N: 04_HDMI_MIPI (P3.7 TP52.1), 09_EXP_CN_100PIN (J1311.40)
MIPI_DSI_D2_P: 04_HDMI_MIPI (P3.6 TP4.1), 09_EXP_CN_100PIN (J1311.42)
MIPI_DSI_D3_N: 04_HDMI_MIPI (P3.19), 09_EXP_CN_100PIN (J1311.46)
MIPI_DSI_D3_P: 04_HDMI_MIPI (P3.18), 09_EXP_CN_100PIN (J1311.48)
NAND_ALE: 03_USB (R11.1 U9.6), 09_EXP_CN_100PIN (J1310.16)
NAND_DATA02: 04_HDMI_MIPI (R136.1), 09_EXP_CN_100PIN (J1310.12)
NAND_DATA03: 08_EXP_CN (J15.16), 09_EXP_CN_100PIN (J1310.22)
NAND_DATA06: 04_HDMI_MIPI (R170.2), 09_EXP_CN_100PIN (J1310.20)
NAND_DATA07: 08_EXP_CN (J15.37), 09_EXP_CN_100PIN (J1310.18)
NetJ1310_10: 07_DEBUG (R205.1), 09_EXP_CN_100PIN (J1310.10)
NetJ1312_30: 07_DEBUG (R179.2), 09_EXP_CN_100PIN (J1312.30)
NetJ1312_86: 07_DEBUG (R191.2), 09_EXP_CN_100PIN (J1312.86)
POR_B: 07_DEBUG (D40.A D42.C), 09_EXP_CN_100PIN (J1310.79)
PWM1: 08_EXP_CN (J15.32), 09_EXP_CN_100PIN (J1312.88)
PWM2: 08_EXP_CN (J15.33), 09_EXP_CN_100PIN (J1312.90)
PWM3: 08_EXP_CN (J15.15), 09_EXP_CN_100PIN (J1312.92)
PWM4: 07_DEBUG (R114.2), 09_EXP_CN_100PIN (J1312.11)
SAI1_RXD0: 08_EXP_CN (J15.38), 09_EXP_CN_100PIN (J1312.33)
SAI1_TXC: 08_EXP_CN (J15.12), 09_EXP_CN_100PIN (J1312.40)
SAI1_TXD0: 08_EXP_CN (J15.40), 09_EXP_CN_100PIN (J1312.44)
SAI1_TXD4: 07_DEBUG (R179.1 SW1.3), 09_EXP_CN_100PIN (J1312.38)
SAI1_TXD5: 07_DEBUG (SW1.4), 09_EXP_CN_100PIN (J1312.34)
SAI1_TXD6: 04_HDMI_MIPI (R172.2), 09_EXP_CN_100PIN (J1312.28)
SAI1_TXD7: 04_HDMI_MIPI (R169.2), 09_EXP_CN_100PIN (J1312.32)
SAI1_TXFS: 08_EXP_CN (J15.35), 09_EXP_CN_100PIN (J1312.46)
SAI2_MCLK: 05_AUDIO (R147.1), 09_EXP_CN_100PIN (J1312.12)
SAI2_RXD: 05_AUDIO (C3.1 U2.35), 09_EXP_CN_100PIN (J1312.20)
SAI2_TXC: 05_AUDIO (C2.2 U2.37), 09_EXP_CN_100PIN (J1312.18)
SAI2_TXD: 05_AUDIO (C1.2 U2.34), 09_EXP_CN_100PIN (J1312.14)
SAI2_TXFS: 05_AUDIO (C4.1 U2.36), 09_EXP_CN_100PIN (J1312.16)
SAI5_MCLK: 08_EXP_CN (R154.1), 09_EXP_CN_100PIN (J1312.50)
SAI5_RXC: 08_EXP_CN (R156.1), 09_EXP_CN_100PIN (J1312.56)
SAI5_RXD0: 08_EXP_CN (R157.1), 09_EXP_CN_100PIN (J1312.58)
SAI5_RXD2: 08_EXP_CN (R155.1), 09_EXP_CN_100PIN (J1312.54)
SAI5_RXFS: 08_EXP_CN (R158.1), 09_EXP_CN_100PIN (J1312.60 TP82.1)
SD2_nCD: 06_GBE_SDCARD (R54.2 R97.2), 09_EXP_CN_100PIN (J1310.24)
SD2_nRST: 07_DEBUG (D41.C), 09_EXP_CN_100PIN (J1310.36)
SD_CD_DAT3: 06_GBE_SDCARD (R160.1), 09_EXP_CN_100PIN (J1310.38)
SD_CLK: 06_GBE_SDCARD (R56.1), 09_EXP_CN_100PIN (J1310.48)
SD_CMD: 06_GBE_SDCARD (R55.1), 09_EXP_CN_100PIN (J1310.26)
SD_DAT0: 06_GBE_SDCARD (R57.1), 09_EXP_CN_100PIN (J1310.28)
SD_DAT1: 06_GBE_SDCARD (R58.1), 09_EXP_CN_100PIN (J1310.32)
SD_DAT2: 06_GBE_SDCARD (R59.1), 09_EXP_CN_100PIN (J1310.34)
SPDIF_RX: 05_AUDIO (R20.2 R181.2), 09_EXP_CN_100PIN (J1311.98)
SYS_NRST: 07_DEBUG (R180.2), 09_EXP_CN_100PIN (J1312.63)
UART1_RXD: 07_DEBUG (R101.1), 08_EXP_CN (J15.10), 09_EXP_CN_100PIN (J1311.95)
UART1_TXD: 07_DEBUG (R102.1), 08_EXP_CN (J15.8), 09_EXP_CN_100PIN (J1311.93)
UART3_RXD: 07_DEBUG (R94.1), 08_EXP_CN (J15.11), 09_EXP_CN_100PIN (J1311.97)
UART3_TXD: 07_DEBUG (R95.1), 08_EXP_CN (J15.7), 09_EXP_CN_100PIN (J1311.91)
USB1_D_N: 03_USB (U16.C5), 09_EXP_CN_100PIN (J1311.53)
USB1_D_P: 03_USB (U16.C6), 09_EXP_CN_100PIN (J1311.51)
USB1_ID: 03_USB (Q3.1 R3.1 U9.9), 09_EXP_CN_100PIN (J1311.76)
USB1_RX_N: 03_USB (C13.1), 09_EXP_CN_100PIN (J1311.66)
USB1_RX_P: 03_USB (C119.1), 09_EXP_CN_100PIN (J1311.64)
USB1_TX_N: 03_USB (C116.1), 09_EXP_CN_100PIN (J1311.60)
USB1_TX_P: 03_USB (C115.1), 09_EXP_CN_100PIN (J1311.58)
USB1_VBUS: 03_USB (R1.1), 09_EXP_CN_100PIN (J1311.82 J1311.84)
USB2_D_N: 03_USB (R28.1), 09_EXP_CN_100PIN (J1311.65)
USB2_D_P: 03_USB (R29.1), 09_EXP_CN_100PIN (J1311.63)
USB2_RX_N: 03_USB (U8.C3), 09_EXP_CN_100PIN (J1311.72)
USB2_RX_P: 03_USB (U8.C4), 09_EXP_CN_100PIN (J1311.70)
USB2_TX_N: 03_USB (C121.1), 09_EXP_CN_100PIN (J1311.71)
USB2_TX_P: 03_USB (C122.1), 09_EXP_CN_100PIN (J1311.69)
USB2_VBUS: 03_USB (R25.1), 09_EXP_CN_100PIN (J1311.75 J1311.77)

## Assembly variants
Production: not fitted C45 D5 D12 J12 OSC1 R14 R18 R20 R22 R68 R69 R74 R75 R78 R79 R89 R93 R96 R97 R99 R105 R106 R107 R109 R110 R111 R116 R122 R126 R140 R146 R148 R149 R155 R156 R157 R158 R159 R175 R176 R177
Prototype: not fitted D5 D12 J12 OSC1 R14 R18 R20 R22 R68 R69 R74 R75 R78 R79 R89 R93 R96 R97 R99 R105 R106 R107 R109 R110 R111 R116 R122 R126 R140 R146 R148 R149 R155 R156 R157 R158 R159 R175 R176 R177